# Altium schematic sheet Sheet.SchDoc
size A
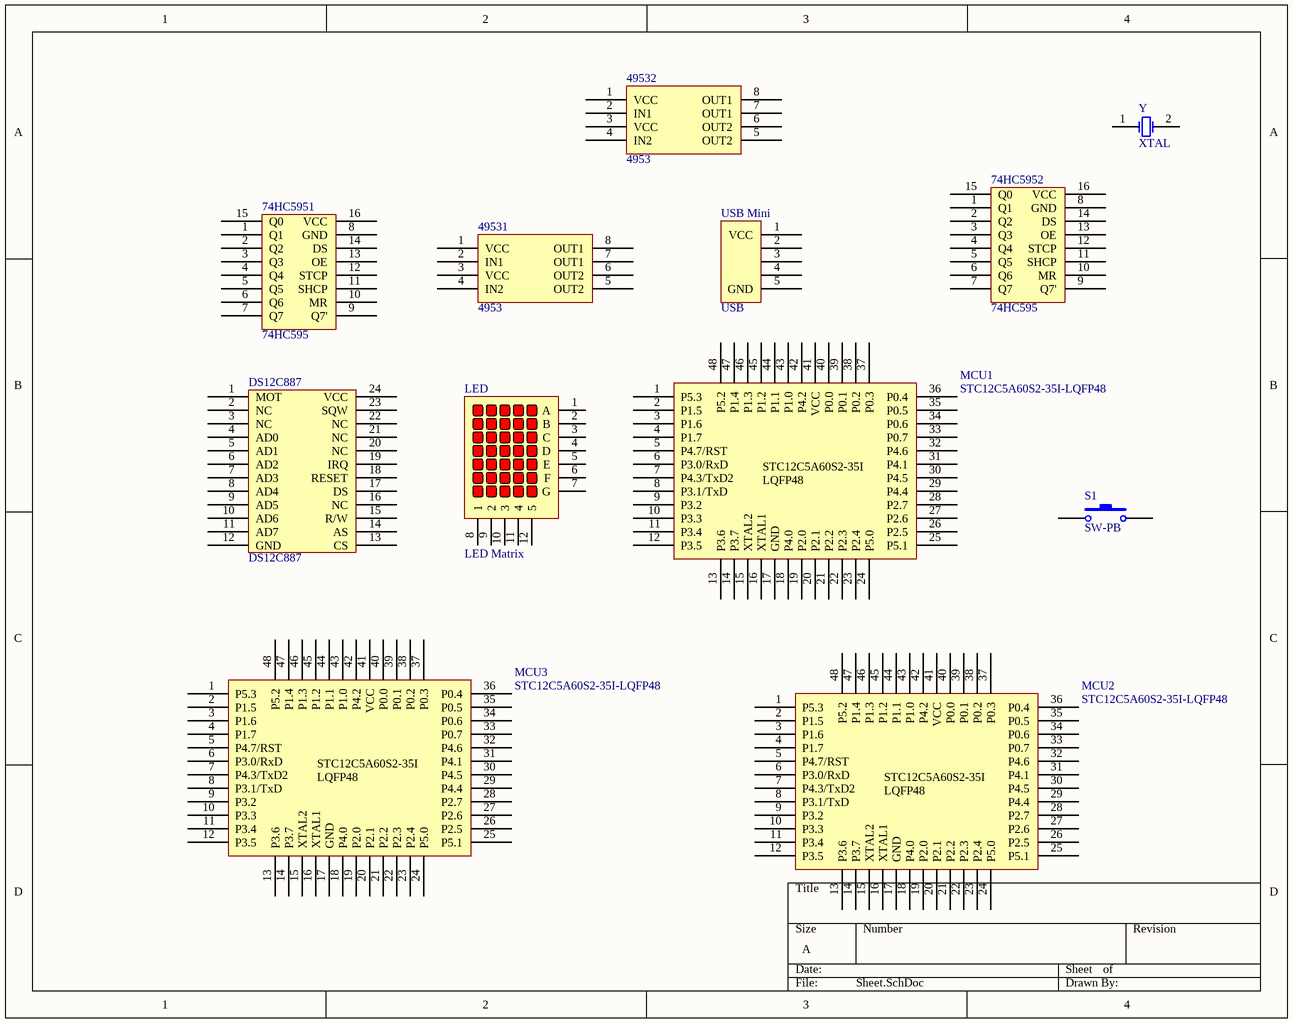
[diagram p0: Sheet.SchDoc]

## Parts
74HC5951  74HC595  [SO-16_L]
74HC5952  74HC595  [SO-16_L]
49531  4953  [SO8_L]
49532  4953  [SO8_L]
DS12C887  DS12C887  [Timer]
LED  LED Matrix  [LED-Matrix 5*7]
MCU1  STC12C5A60S2-35I-LQFP48  [MCU]
MCU2  STC12C5A60S2-35I-LQFP48  [MCU]
MCU3  STC12C5A60S2-35I-LQFP48  [MCU]
S1  SW-PB  [Button]
USB_Mini  USB  [USBfoot]
Y  XTAL  [5023]

## Nets

Not connected (* = marked no-connect by the designer): 74HC5951 1(Q1) 2(Q2) 3(Q3) 4(Q4) 5(Q5) 6(Q6) 7(Q7) 8(GND) 9(Q7') 10(MR) 11(SHCP) 12(STCP) 13(OE) 14(DS) 15(Q0) 16(VCC); 74HC5952 1(Q1) 2(Q2) 3(Q3) 4(Q4) 5(Q5) 6(Q6) 7(Q7) 8(GND) 9(Q7') 10(MR) 11(SHCP) 12(STCP) 13(OE) 14(DS) 15(Q0) 16(VCC); 49531 1(VCC) 2(IN1) 3(VCC) 4(IN2) 5(OUT2) 6(OUT2) 7(OUT1) 8(OUT1); 49532 1(VCC) 2(IN1) 3(VCC) 4(IN2) 5(OUT2) 6(OUT2) 7(OUT1) 8(OUT1); DS12C887 1(MOT) 2(NC) 3(NC) 4(AD0) 5(AD1) 6(AD2) 7(AD3) 8(AD4) 9(AD5) 10(AD6) 11(AD7) 12(GND) 13(CS) 14(AS) 15(R/W) 16(NC) 17(DS) 18(RESET) 19(IRQ) 20(NC) 21(NC) 22(NC) 23(SQW) 24(VCC); LED 1(A) 2(B) 3(C) 4(D) 5(E) 6(F) 7(G) 8(1) 9(2) 10(3) 11(4) 12(5); MCU1 1(P5.3) 2(P1.5) 3(P1.6) 4(P1.7) 5(P4.7/RST) 6(P3.0/RxD) 7(P4.3/TxD2) 8(P3.1/TxD) 9(P3.2) 10(P3.3) 11(P3.4) 12(P3.5) 13(P3.6) 14(P3.7) 15(XTAL2) 16(XTAL1) 17(GND) 18(P4.0) 19(P2.0) 20(P2.1) 21(P2.2) 22(P2.3) 23(P2.4) 24(P5.0) 25(P5.1) 26(P2.5) 27(P2.6) 28(P2.7) 29(P4.4) 30(P4.5) 31(P4.1) 32(P4.6) 33(P0.7) 34(P0.6) 35(P0.5) 36(P0.4) 37(P0.3) 38(P0.2) 39(P0.1) 40(P0.0) 41(VCC) 42(P4.2) 43(P1.0) 44(P1.1) 45(P1.2) 46(P1.3) 47(P1.4) 48(P5.2); MCU2 1(P5.3) 2(P1.5) 3(P1.6) 4(P1.7) 5(P4.7/RST) 6(P3.0/RxD) 7(P4.3/TxD2) 8(P3.1/TxD) 9(P3.2) 10(P3.3) 11(P3.4) 12(P3.5) 13(P3.6) 14(P3.7) 15(XTAL2) 16(XTAL1) 17(GND) 18(P4.0) 19(P2.0) 20(P2.1) 21(P2.2) 22(P2.3) 23(P2.4) 24(P5.0) 25(P5.1) 26(P2.5) 27(P2.6) 28(P2.7) 29(P4.4) 30(P4.5) 31(P4.1) 32(P4.6) 33(P0.7) 34(P0.6) 35(P0.5) 36(P0.4) 37(P0.3) 38(P0.2) 39(P0.1) 40(P0.0) 41(VCC) 42(P4.2) 43(P1.0) 44(P1.1) 45(P1.2) 46(P1.3) 47(P1.4) 48(P5.2); MCU3 1(P5.3) 2(P1.5) 3(P1.6) 4(P1.7) 5(P4.7/RST) 6(P3.0/RxD) 7(P4.3/TxD2) 8(P3.1/TxD) 9(P3.2) 10(P3.3) 11(P3.4) 12(P3.5) 13(P3.6) 14(P3.7) 15(XTAL2) 16(XTAL1) 17(GND) 18(P4.0) 19(P2.0) 20(P2.1) 21(P2.2) 22(P2.3) 23(P2.4) 24(P5.0) 25(P5.1) 26(P2.5) 27(P2.6) 28(P2.7) 29(P4.4) 30(P4.5) 31(P4.1) 32(P4.6) 33(P0.7) 34(P0.6) 35(P0.5) 36(P0.4) 37(P0.3) 38(P0.2) 39(P0.1) 40(P0.0) 41(VCC) 42(P4.2) 43(P1.0) 44(P1.1) 45(P1.2) 46(P1.3) 47(P1.4) 48(P5.2); S1 1 2; USB_Mini 1(VCC) 2 3 4 5(GND); Y 1(OSC1) 2(OSC2)

## Notes on the sheet
- (in symbol STC12C5A60S2-35I-LQFP48) STC12C5A60S2-35I / LQFP48

## Library data of the parts
LED = LED-Matrix 5*7: MinimumIntensity: 360 ucd; Note: IF = 5 mA; Note: Pins 1 and 6 are redundant Anodes.; Published: 8-Jun-2000; LatestRevisionDate: 17-Dec-2003; LatestRevisionNote: Schematic revised, PCB Footprint replaced.; DatasheetDocument: 19-Feb-2002; PackageDocument: 19-Feb-2002; PackageReference: LEDDIP-10; Publisher: Altium Limited; Colour: High Efficiency Red (HER); ComponentLink1Description: Manufacturer Link; ComponentLink1URL: http://www.agilent.com/
S1 = SW-PB: Switch; Published: 24-Mar-1999; LatestRevisionDate: 17-Jul-2002; LatestRevisionNote: Re-released for DXP Platform.; PackageReference: SPST-2; Publisher: Altium Limited; PackageDescription: Switch; 2 Leads
Y = XTAL: Crystal Oscillator; Published: 8-Jun-2000; LatestRevisionDate: 17-Jul-2002; LatestRevisionNote: Re-released for DXP Platform.; PackageReference: R38; Publisher: Altium Limited; PackageDescription: Crystal, Thru-Hole; 2 Leads; Body 3.1 x 8.2 mm (Dia.xH)